# EasyEDA schematic 1-Schematic_Synapse.json

## Sheets
1 Arduino: TITLE: Synapse; REV: 1.1; Date: 2020-05-31; Sheet: 1/3; Drawn By: Arthur LAURENT; Company: Mental Noise
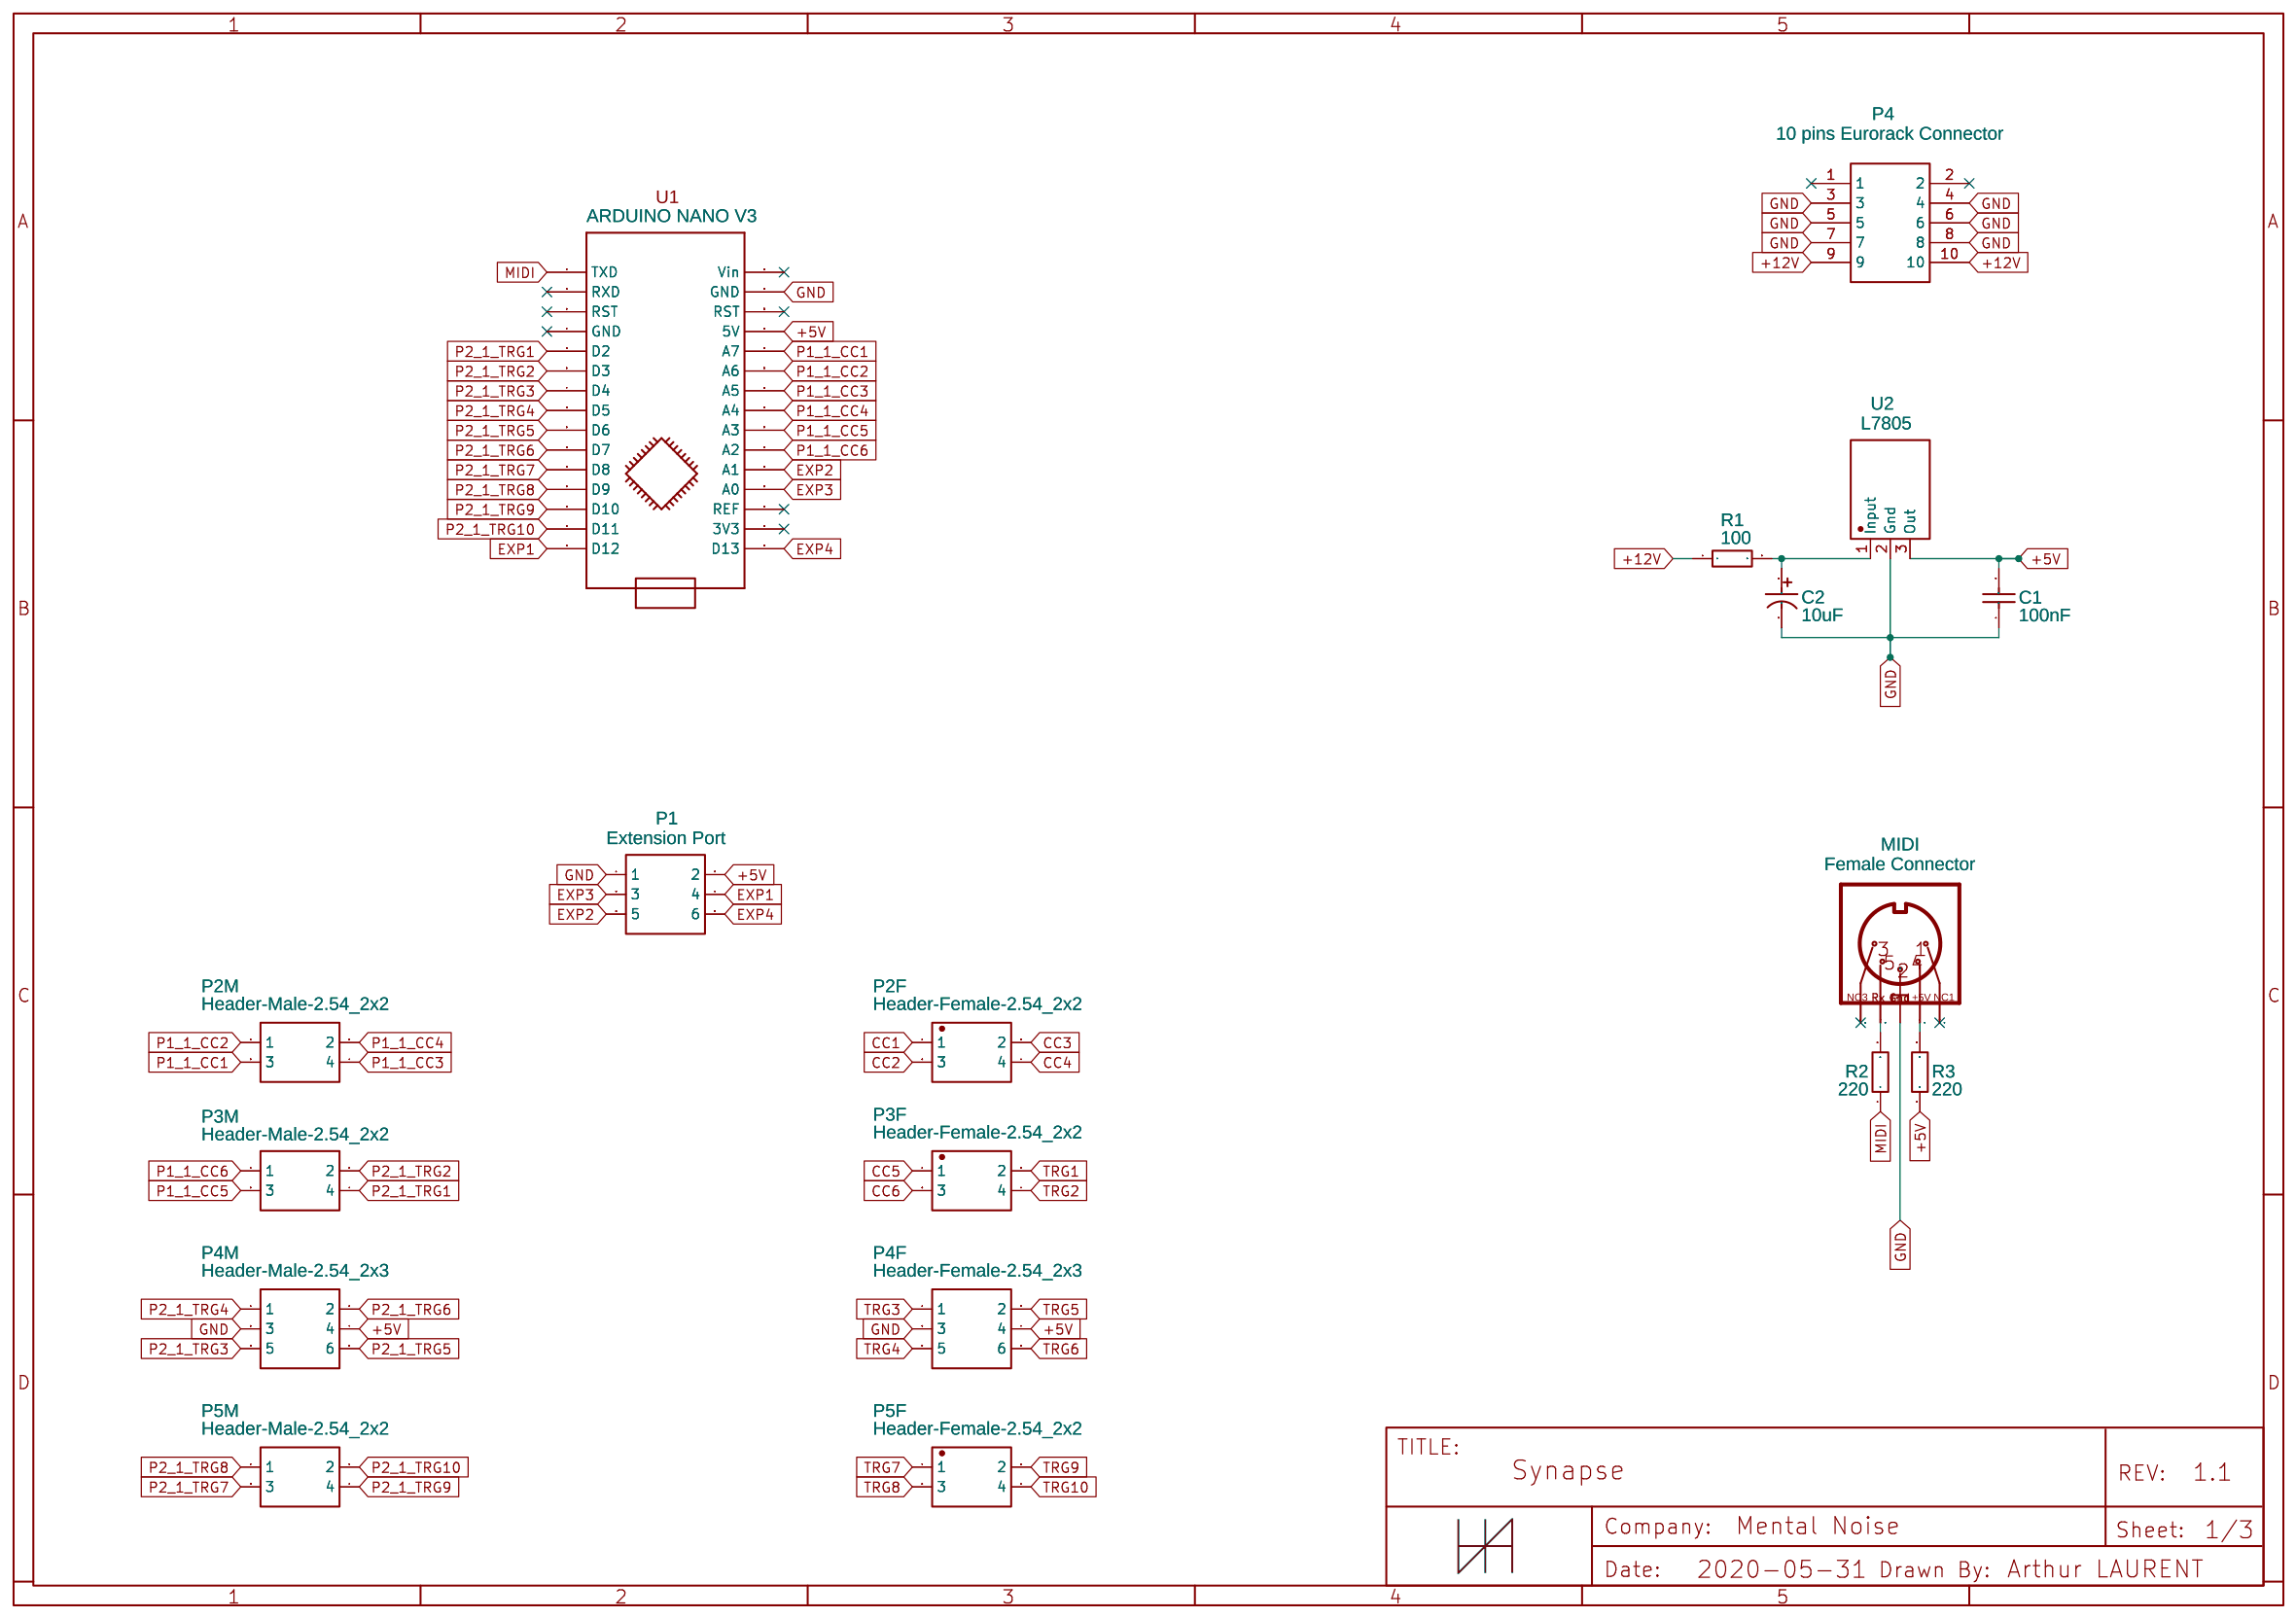
[diagram p0: Arduino]
2 Control Change: Sheet: 2/3
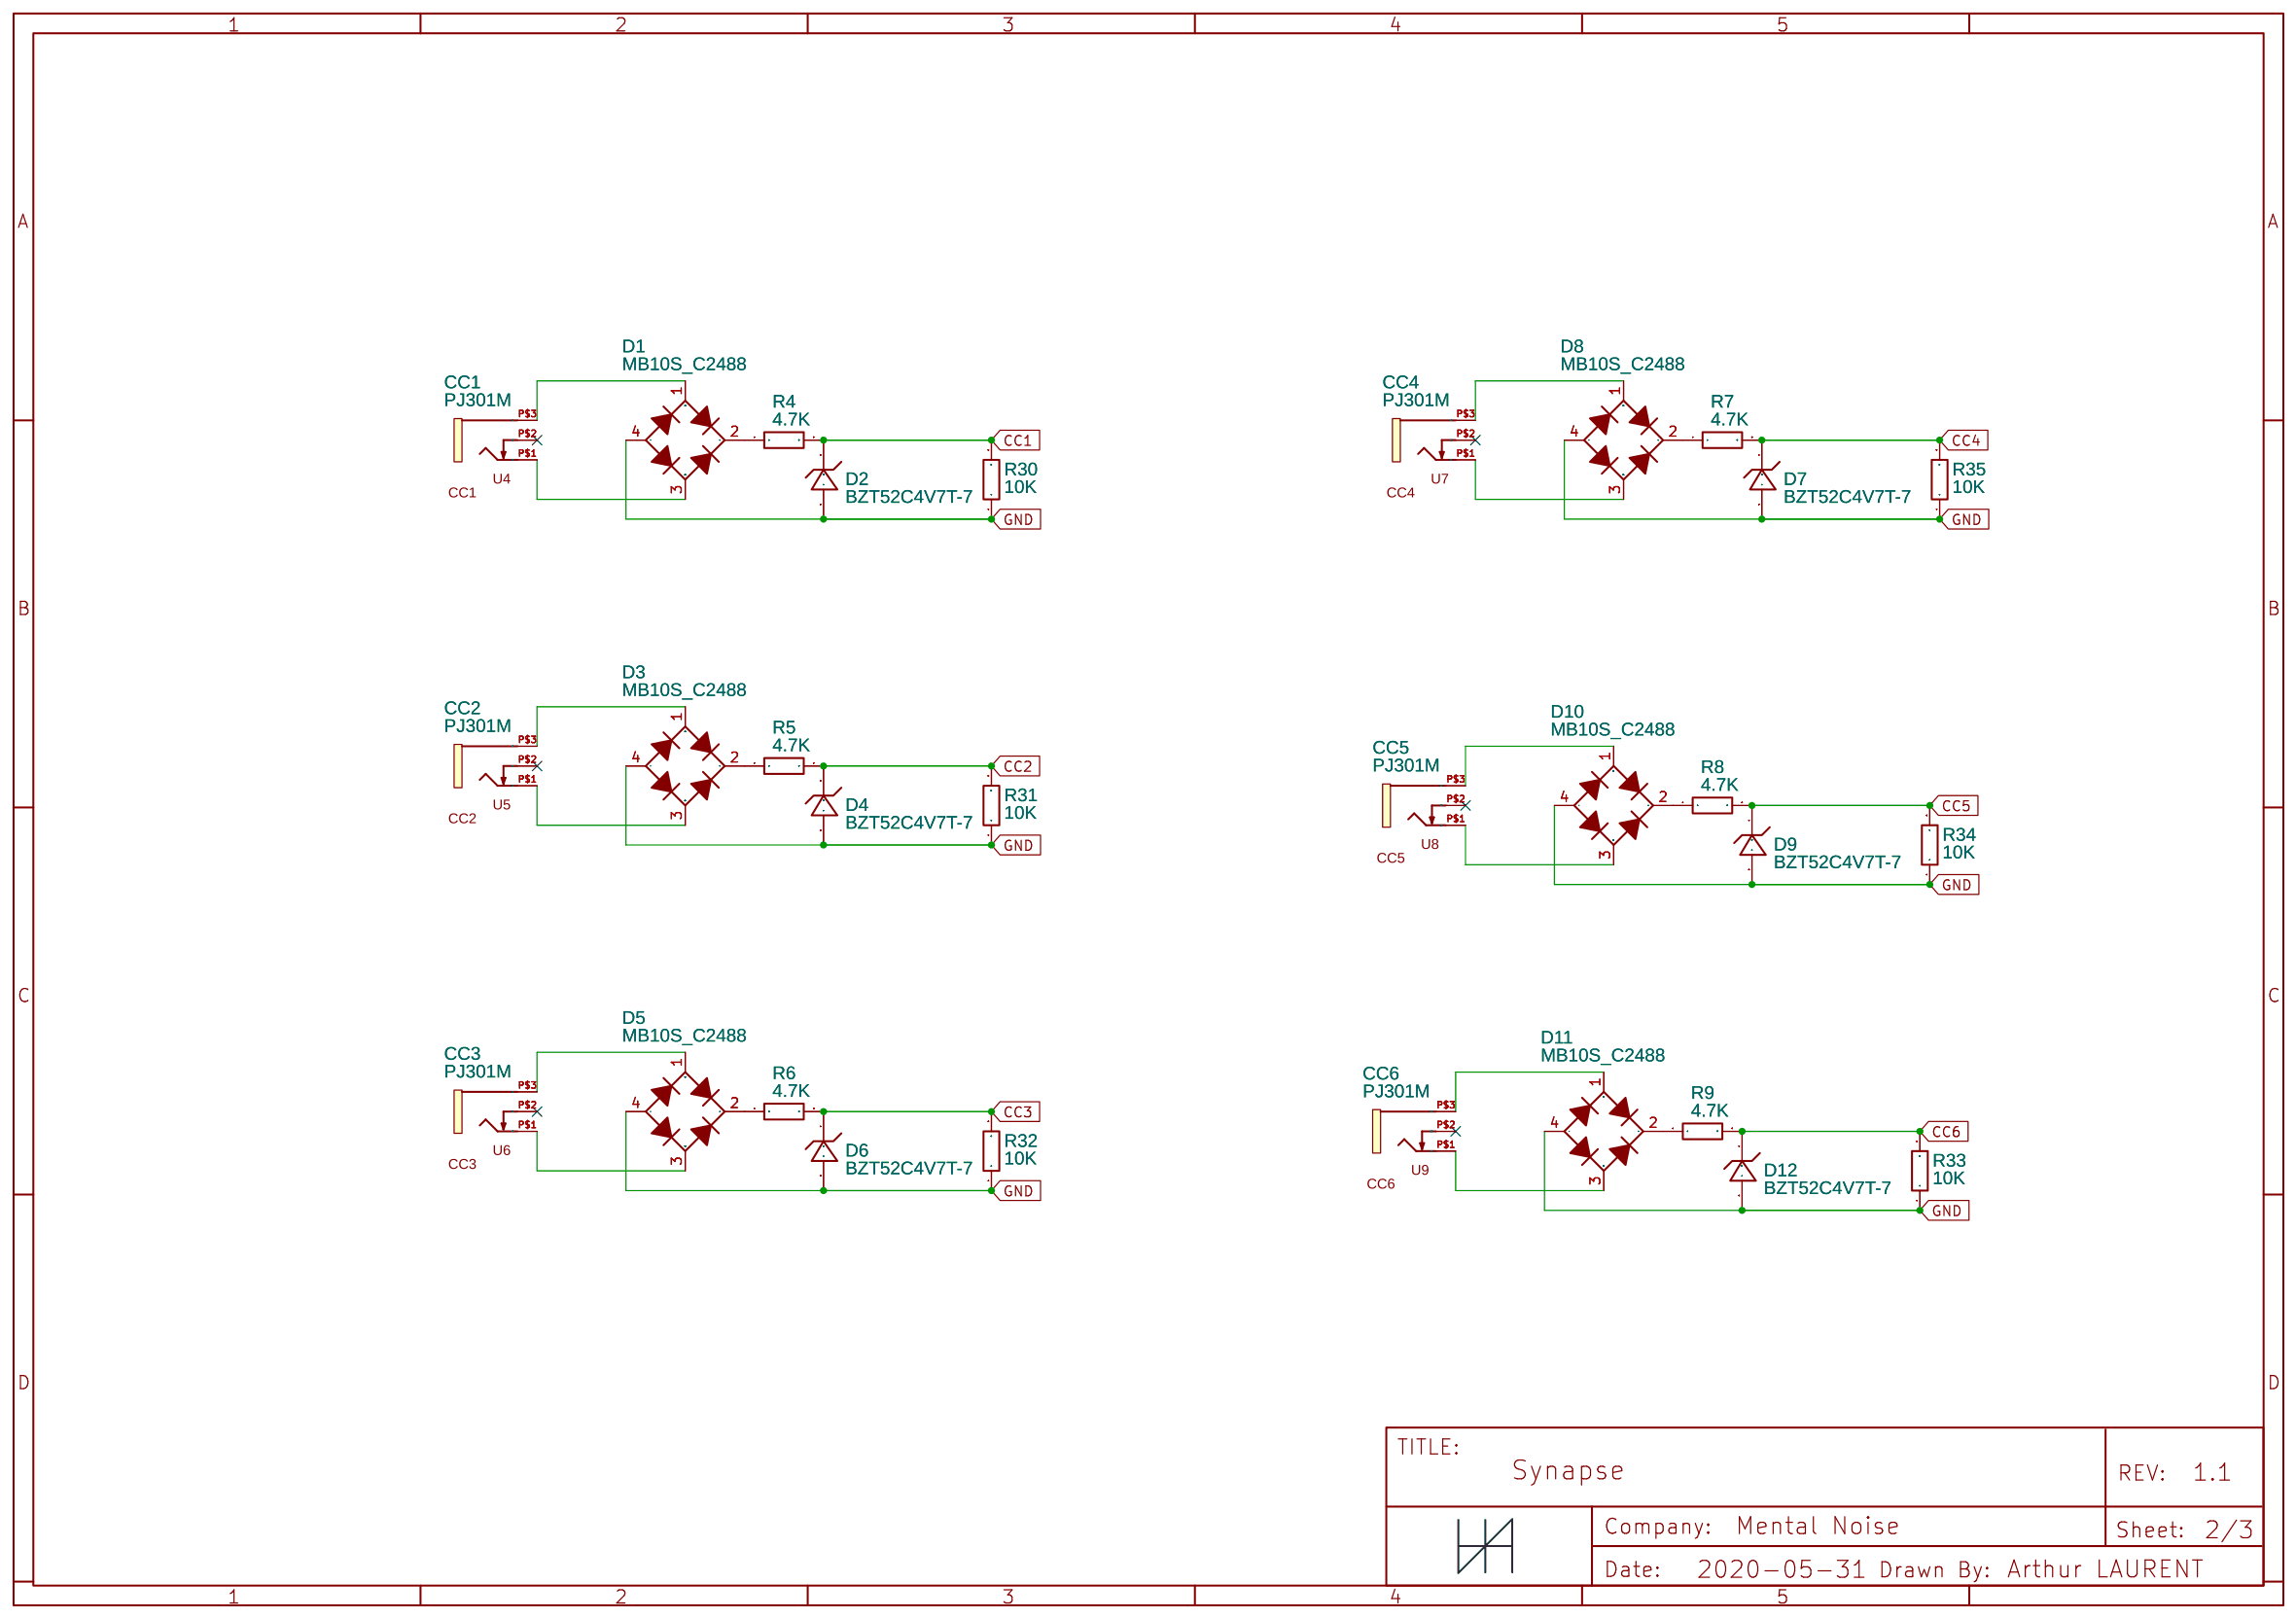
[diagram p1: Control Change]
3 Trigger: Sheet: 3/3
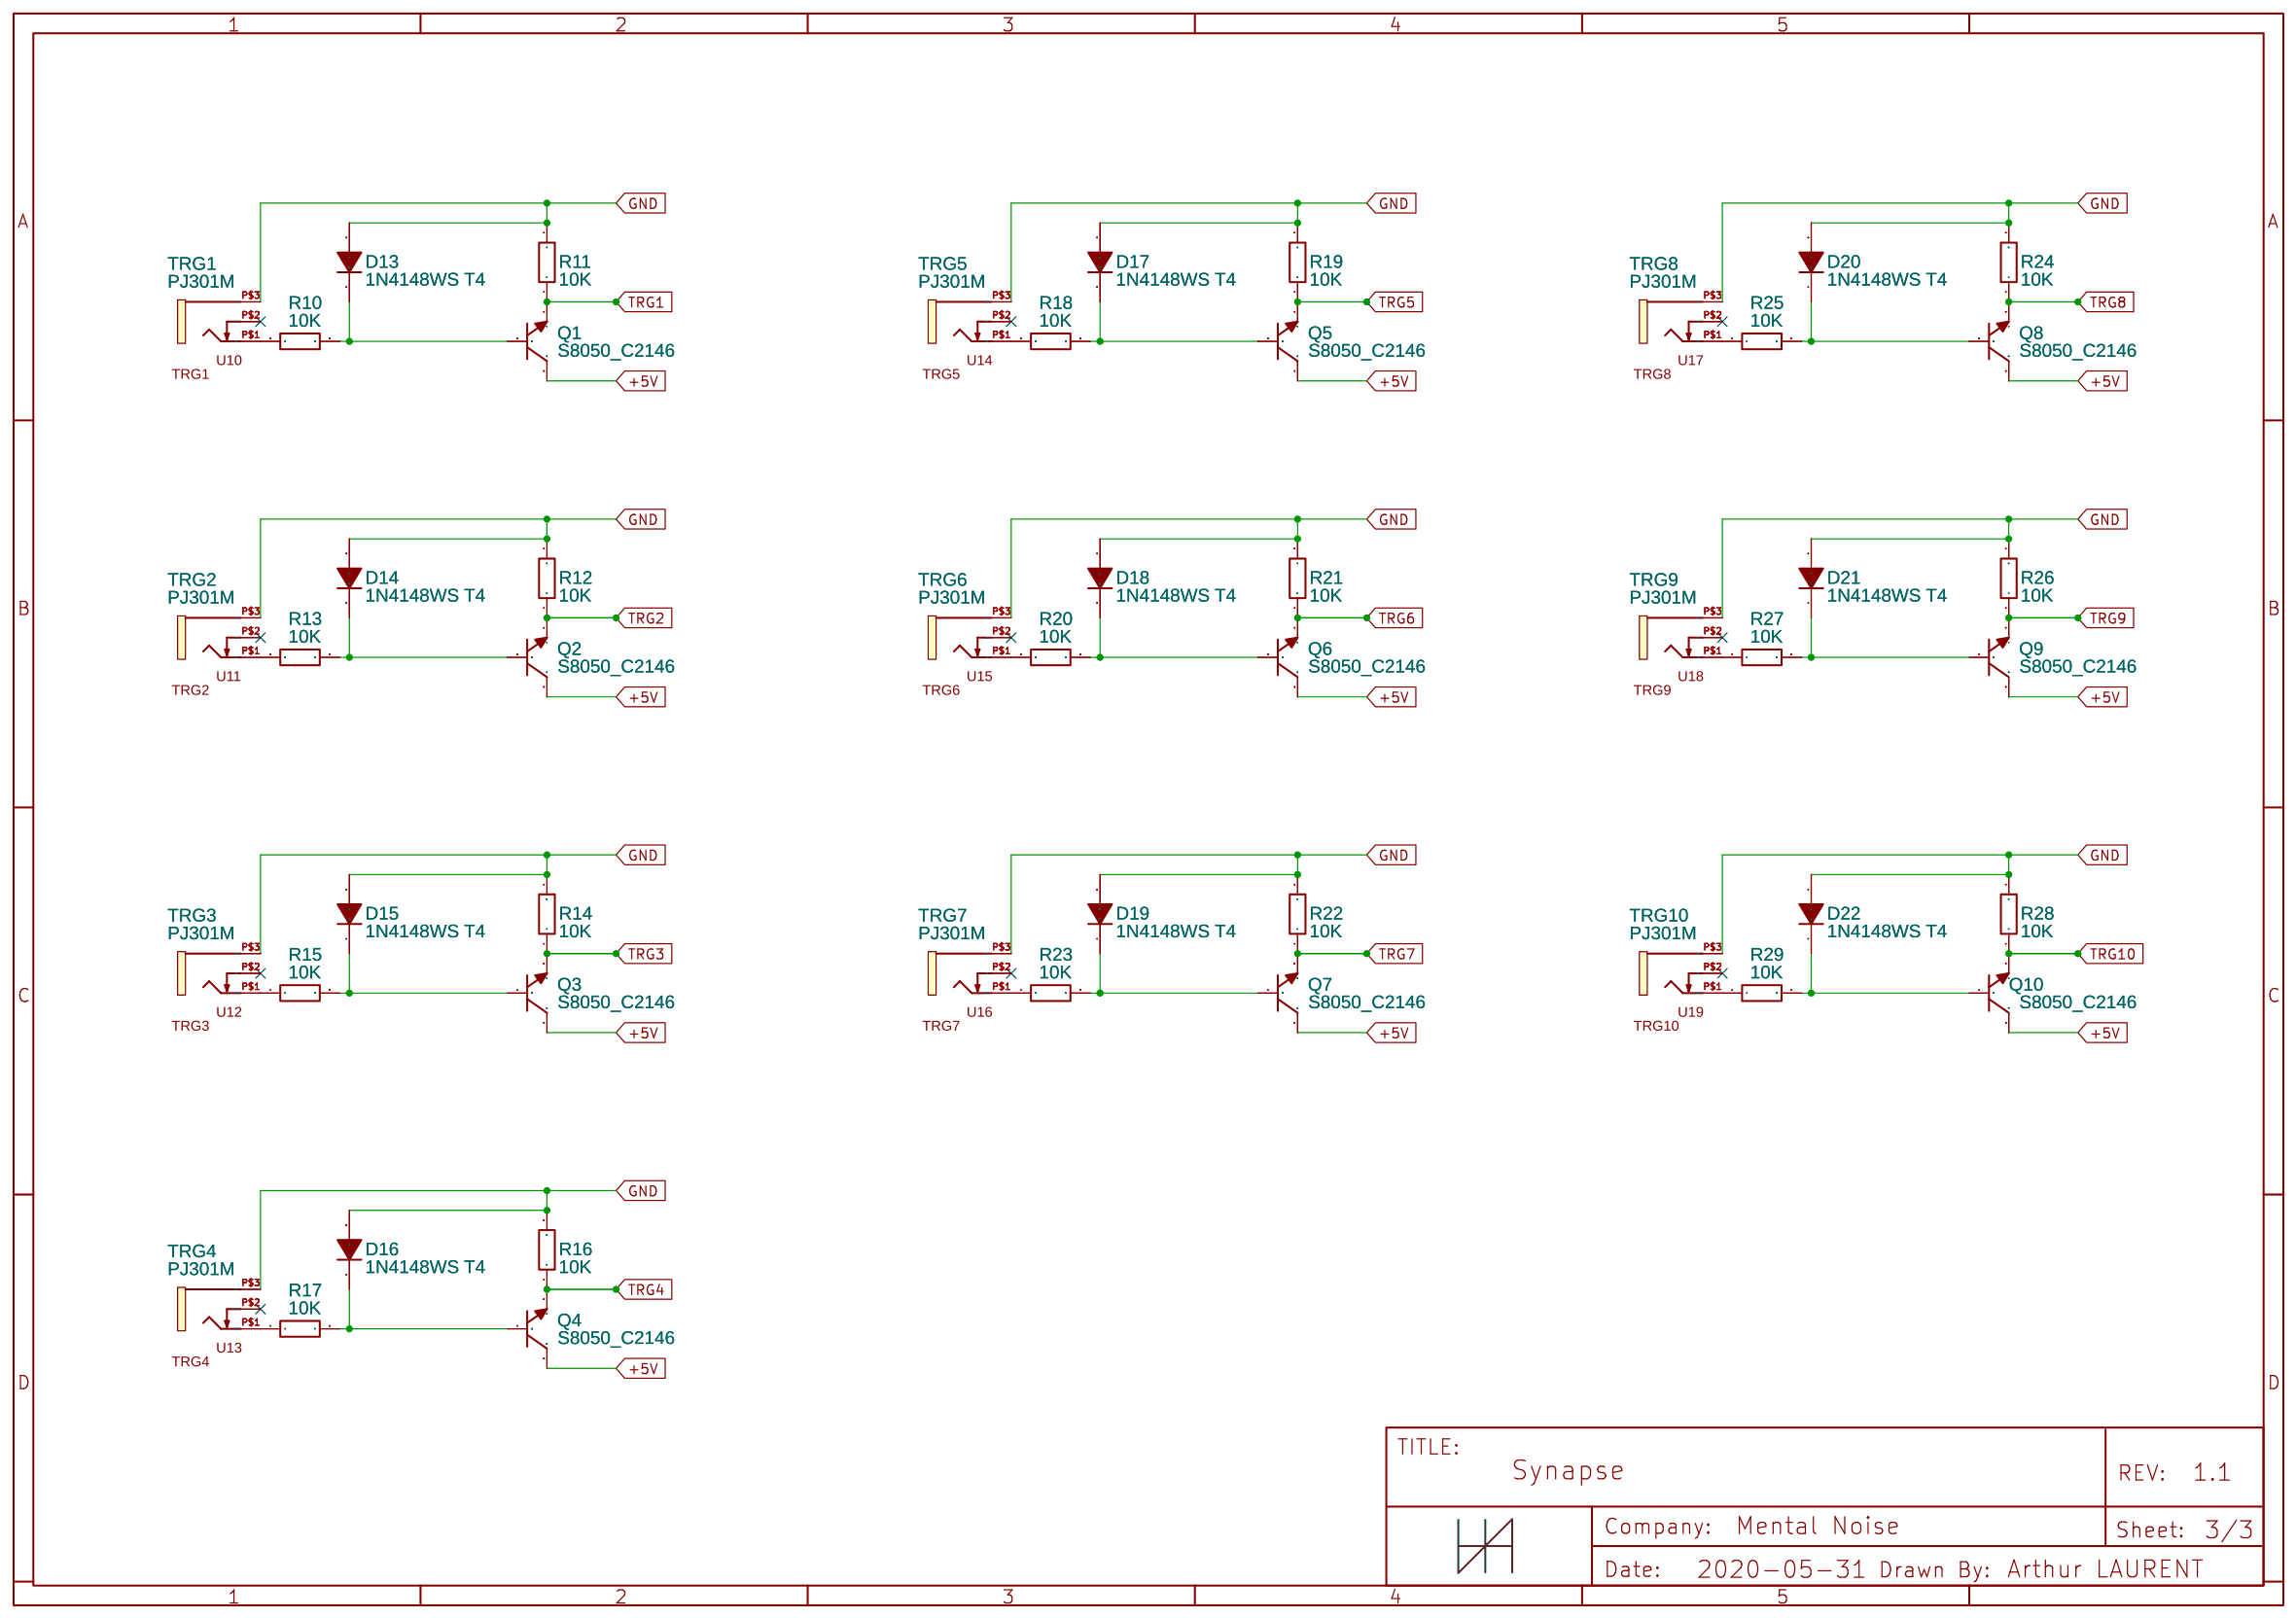
[diagram p2: Trigger]

## Parts
sheet Arduino
C1  100nF  [CERAMIC CAPACITOR_100NF]
C2  10uF  [CAP-TH_BD5.0-P2.00-D0.8-FD]
MIDI  Female Connector  [POT-REMOTE]
P1  Extension Port  [IDC-TH_6P-P2.54_C11214]
P2F  Header-Female-2.54_2x2  [HDR-TH_4P-P2.54-V-R2-C2-S2.54]
P2M  Header-Male-2.54_2x2  [HDR-TH_4P-P2.54-V-R2-C2-S2.54]
P3F  Header-Female-2.54_2x2  [HDR-TH_4P-P2.54-V-R2-C2-S2.54]
P3M  Header-Male-2.54_2x2  [HDR-TH_4P-P2.54-V-R2-C2-S2.54]
P4  10 pins Eurorack Connector  [IDC-TH_10P-P2.54-V-R2-C5-S2.54]
P4F  Header-Female-2.54_2x3  [HDR-TH_6P-P2.54-V-R2-C3-S2.54]
P4M  Header-Male-2.54_2x3  [HDR-TH_6P-P2.54-V-R2-C3-S2.54]
P5F  Header-Female-2.54_2x2  [HDR-TH_4P-P2.54-V-R2-C2-S2.54]
P5M  Header-Male-2.54_2x2  [HDR-TH_4P-P2.54-V-R2-C2-S2.54]
R1  100  [1/4W RESISTOR]
R2  220  [1/4W RESISTOR]
R3  220  [1/4W RESISTOR]
U1  ARDUINO NANO V3  [ARDUINO NANO V3]
U2  L7805  [TO-220-3_L10.0-W4.5-P2.54-L]
sheet Control Change
CC1  PJ301M  [PJ301M]
CC2  PJ301M  [PJ301M]
CC3  PJ301M  [PJ301M]
CC4  PJ301M  [PJ301M]
CC5  PJ301M  [PJ301M]
CC6  PJ301M  [PJ301M]
D1  MB10S_C2488  [DIO-BG-SMD_4P-L4.9-W4.0-P2.54-LS7.0-TL]
D2  BZT52C4V7T-7  [SOD-523_L1.2-W0.8-LS1.6-RD]
D3  MB10S_C2488  [DIO-BG-SMD_4P-L4.9-W4.0-P2.54-LS7.0-TL]
D4  BZT52C4V7T-7  [SOD-523_L1.2-W0.8-LS1.6-RD]
D5  MB10S_C2488  [DIO-BG-SMD_4P-L4.9-W4.0-P2.54-LS7.0-TL]
D6  BZT52C4V7T-7  [SOD-523_L1.2-W0.8-LS1.6-RD]
D7  BZT52C4V7T-7  [SOD-523_L1.2-W0.8-LS1.6-RD]
D8  MB10S_C2488  [DIO-BG-SMD_4P-L4.9-W4.0-P2.54-LS7.0-TL]
D9  BZT52C4V7T-7  [SOD-523_L1.2-W0.8-LS1.6-RD]
D10  MB10S_C2488  [DIO-BG-SMD_4P-L4.9-W4.0-P2.54-LS7.0-TL]
D11  MB10S_C2488  [DIO-BG-SMD_4P-L4.9-W4.0-P2.54-LS7.0-TL]
D12  BZT52C4V7T-7  [SOD-523_L1.2-W0.8-LS1.6-RD]
R4  4.7K  [R0402]
R5  4.7K  [R0402]
R6  4.7K  [R0402]
R7  4.7K  [R0402]
R8  4.7K  [R0402]
R9  4.7K  [R0402]
R30  10K  [R0402]
R31  10K  [R0402]
R32  10K  [R0402]
R33  10K  [R0402]
R34  10K  [R0402]
R35  10K  [R0402]
sheet Trigger
D13  1N4148WS T4  [SOD-323_L1.8-W1.3-LS2.5-RD]
D14  1N4148WS T4  [SOD-323_L1.8-W1.3-LS2.5-RD]
D15  1N4148WS T4  [SOD-323_L1.8-W1.3-LS2.5-RD]
D16  1N4148WS T4  [SOD-323_L1.8-W1.3-LS2.5-RD]
D17  1N4148WS T4  [SOD-323_L1.8-W1.3-LS2.5-RD]
D18  1N4148WS T4  [SOD-323_L1.8-W1.3-LS2.5-RD]
D19  1N4148WS T4  [SOD-323_L1.8-W1.3-LS2.5-RD]
D20  1N4148WS T4  [SOD-323_L1.8-W1.3-LS2.5-RD]
D21  1N4148WS T4  [SOD-323_L1.8-W1.3-LS2.5-RD]
D22  1N4148WS T4  [SOD-323_L1.8-W1.3-LS2.5-RD]
Q1  S8050_C2146  [SOT-23-3_L3.0-W1.7-P0.95-LS2.9-BR]
Q2  S8050_C2146  [SOT-23-3_L3.0-W1.7-P0.95-LS2.9-BR]
Q3  S8050_C2146  [SOT-23-3_L3.0-W1.7-P0.95-LS2.9-BR]
Q4  S8050_C2146  [SOT-23-3_L3.0-W1.7-P0.95-LS2.9-BR]
Q5  S8050_C2146  [SOT-23-3_L3.0-W1.7-P0.95-LS2.9-BR]
Q6  S8050_C2146  [SOT-23-3_L3.0-W1.7-P0.95-LS2.9-BR]
Q7  S8050_C2146  [SOT-23-3_L3.0-W1.7-P0.95-LS2.9-BR]
Q8  S8050_C2146  [SOT-23-3_L3.0-W1.7-P0.95-LS2.9-BR]
Q9  S8050_C2146  [SOT-23-3_L3.0-W1.7-P0.95-LS2.9-BR]
Q10  S8050_C2146  [SOT-23-3_L3.0-W1.7-P0.95-LS2.9-BR]
R10  10K  [R0402]
R11  10K  [R0402]
R12  10K  [R0402]
R13  10K  [R0402]
R14  10K  [R0402]
R15  10K  [R0402]
R16  10K  [R0402]
R17  10K  [R0402]
R18  10K  [R0402]
R19  10K  [R0402]
R20  10K  [R0402]
R21  10K  [R0402]
R22  10K  [R0402]
R23  10K  [R0402]
R24  10K  [R0402]
R25  10K  [R0402]
R26  10K  [R0402]
R27  10K  [R0402]
R28  10K  [R0402]
R29  10K  [R0402]
TRG1  PJ301M  [PJ301M]
TRG2  PJ301M  [PJ301M]
TRG3  PJ301M  [PJ301M]
TRG4  PJ301M  [PJ301M]
TRG5  PJ301M  [PJ301M]
TRG6  PJ301M  [PJ301M]
TRG7  PJ301M  [PJ301M]
TRG8  PJ301M  [PJ301M]
TRG9  PJ301M  [PJ301M]
TRG10  PJ301M  [PJ301M]

## Library data of the parts
C1 = CERAMIC CAPACITOR_100nF: Manufacturer Part: Ceramic capacitor0.1UF50V; Contributor: dearali
C2 = 10uF 50V 5*11: Supplier: LCSC; Manufacturer: ValuePro; Supplier Part: C43345
MIDI = MIDI Connector: Contributor: Janosch_89
P1 = HDR-IDC-2.54-2X3P: Supplier: LCSC; Manufacturer: BOOMELE; Manufacturer Part: 2X3 2.54mm IDC Box; image: //image.lceda.cn/szlcsc/C11214.jpg; Supplier Part: C11214
P2F P3F P5F = Header-Female-2.54_2x2: Supplier: LCSC; Manufacturer: CONNFLY; Manufacturer Part: DS1023-2*2SF11; Contributor: LCSC; Supplier Part: C92273
P2M P3M P5M = Header-Male-2.54_2x2: Supplier: LCSC; Manufacturer: BOOMELE; Manufacturer Part: Double Rows2.54mm2*2pHeaders  Pins; Supplier Part: C66690
P4 = CONN ISP 10P: Supplier: LCSC; Manufacturer: SAMTEC; Manufacturer Part: TST-105-02-G-D; Contributor: LCSC; Supplier Part: C131327
P4F = Header-Female-2.54_2x3: Supplier: LCSC; Manufacturer: CONNFLY; Manufacturer Part: DS1023-2*3SF11; Contributor: LCSC; Supplier Part: C92272
P4M = Header-Male-2.54_2x3: Supplier: LCSC; Manufacturer: BOOMELE; Supplier Part: C65114
R1 = MF1/4W-100Ω±1% T52: Supplier: LCSC; Supplier Part: C119304; Manufacturer: Chian Chia Elec; Contributor: LCSC
R2 R3 = MFR0W4F2200A50: Supplier: LCSC; Manufacturer: UniOhm; Supplier Part: C57439
U1 = ARDUINO NANO V3: Manufacturer Part: arduino_nano1; Contributor: Labamich netvoll
U2 = L7805CV_C347289: Supplier: LCSC; Supplier Part: C347289; Manufacturer: Youtai Semiconductor Co., Ltd.; Manufacturer Part: L7805CV; Contributor: LCSC
CC1-CC6 TRG1-TRG10 = PJ301M: Manufacturer: thonk; link: https://www.thonk.co.uk/shop/thonkiconn/; Contributor: Christian Bloch
D1 D3 D5 D8 D10 D11 = MB10S_C2488: Supplier: LCSC; Manufacturer: MDD; Manufacturer Part: MB10S; LCSC Assembly: Yes; image: //image.lceda.cn/szlcsc/C2488.jpg; Supplier Part: C2488; SMT Type: Basic
D2 D4 D6 D7 D9 D12 = BZT52C4V7T-7: Supplier Part: C151452; Supplier: LCSC; Manufacturer: DIODES; Contributor: LCSC; LCSC Assembly: Yes; SMT Type: Extend
R4-R9 = 0402WGF4701TCE: Supplier: LCSC; Manufacturer: UniOhm; LCSC Assembly: Yes; Supplier Part: C25900; SMT Type: Basic
R10-R35 = 0402WGF1002TCE: Supplier: LCSC; Manufacturer: UniOhm; LCSC Assembly: Yes; Supplier Part: C25744; SMT Type: Basic
D13-D22 = 1N4148WS T4: Supplier: LCSC; Manufacturer: CJ; LCSC Assembly: Yes; image: //image.lceda.cn/szlcsc/C2128.jpg; Supplier Part: C2128; SMT Type: Basic
Q1-Q10 = S8050_C2146: Supplier: LCSC; Manufacturer: CJ; Manufacturer Part: S8050; image: //image.lceda.cn/szlcsc/C2146.jpg; Supplier Part: C2146; LCSC Assembly: Yes; SMT Type: Basic

## Nets
+5V: C1.2 P1.2 P4F.4 P4M.4 Q1.3(C) Q2.3(C) Q3.3(C) Q4.3(C) Q5.3(C) Q6.3(C) Q7.3(C) Q8.3(C) Q9.3(C) Q10.3(C) R3.1 U1.27(5V) U2.3(Out)
+12V: P4.9 P4.10 R1.1
GND: C1.1 C2.2 D1.4(-) D2.2(A) D3.4(-) D4.2(A) D5.4(-) D6.2(A) D7.2(A) D8.4(-) D9.2(A) D10.4(-) D11.4(-) D12.2(A) D13.2(A) D14.2(A) D15.2(A) D16.2(A) D17.2(A) D18.2(A) D19.2(A) D20.2(A) D21.2(A) D22.2(A) MIDI.2 P1.1 P4.3 P4.4 P4.5 P4.6 P4.7 P4.8 P4F.3 P4M.3 R11.2 R12.2 R14.2 R16.2 R19.2 R21.2 R22.2 R24.2 R26.2 R28.2 R30.1 R31.1 R32.1 R33.1 R34.1 R35.1 TRG1.P$3(1) TRG2.P$3(1) TRG3.P$3(1) TRG4.P$3(1) TRG5.P$3(1) TRG6.P$3(1) TRG7.P$3(1) TRG8.P$3(1) TRG9.P$3(1) TRG10.P$3(1) U1.29(GND) U2.2(Gnd)
CC1: D2.1(C) P2F.1 R4.2 R30.2
CC2: D4.1(C) P2F.3 R5.2 R31.2
CC3: D6.1(C) P2F.2 R6.2 R32.2
CC4: D7.1(C) P2F.4 R7.2 R35.2
CC5: D9.1(C) P3F.1 R8.2 R34.2
CC6: D12.1(C) P3F.3 R9.2 R33.2
EXP1: P1.4 U1.15(D12)
EXP2: P1.5 U1.20(A1)
EXP3: P1.3 U1.19(A0)
EXP4: P1.6 U1.16(D13)
MIDI: R2.1 U1.1(TXD)
P1_1_CC1: P2M.3 U1.26(A7)
P1_1_CC2: P2M.1 U1.25(A6)
P1_1_CC3: P2M.4 U1.24(A5)
P1_1_CC4: P2M.2 U1.23(A4)
P1_1_CC5: P3M.3 U1.22(A3)
P1_1_CC6: P3M.1 U1.21(A2)
P2_1_TRG1: P3M.4 U1.5(D2)
P2_1_TRG2: P3M.2 U1.6(D3)
P2_1_TRG3: P4M.5 U1.7(D4)
P2_1_TRG4: P4M.1 U1.8(D5)
P2_1_TRG5: P4M.6 U1.9(D6)
P2_1_TRG6: P4M.2 U1.10(D7)
P2_1_TRG7: P5M.3 U1.11(D8)
P2_1_TRG8: P5M.1 U1.12(D9)
P2_1_TRG9: P5M.4 U1.13(D10)
P2_1_TRG10: P5M.2 U1.14(D11)
TRG1: P3F.2 Q1.2(E) R11.1
TRG2: P3F.4 Q2.2(E) R12.1
TRG3: P4F.1 Q3.2(E) R14.1
TRG4: P4F.5 Q4.2(E) R16.1
TRG5: P4F.2 Q5.2(E) R19.1
TRG6: P4F.6 Q6.2(E) R21.1
TRG7: P5F.1 Q7.2(E) R22.1
TRG8: P5F.3 Q8.2(E) R24.1
TRG9: P5F.2 Q9.2(E) R26.1
TRG10: P5F.4 Q10.2(E) R28.1
Net-(C2-1): C2.1 R1.2 U2.1(Input)
Net-(CC1-P$1): CC1.P$1(2) D1.3(C2)
Net-(CC1-P$3): CC1.P$3(1) D1.1(C1)
Net-(CC2-P$1): CC2.P$1(2) D3.3(C2)
Net-(CC2-P$3): CC2.P$3(1) D3.1(C1)
Net-(CC3-P$1): CC3.P$1(2) D5.3(C2)
Net-(CC3-P$3): CC3.P$3(1) D5.1(C1)
Net-(CC4-P$1): CC4.P$1(2) D8.3(C2)
Net-(CC4-P$3): CC4.P$3(1) D8.1(C1)
Net-(CC5-P$1): CC5.P$1(2) D10.3(C2)
Net-(CC5-P$3): CC5.P$3(1) D10.1(C1)
Net-(CC6-P$1): CC6.P$1(2) D11.3(C2)
Net-(CC6-P$3): CC6.P$3(1) D11.1(C1)
Net-(D1-2): D1.2(+) R4.1
Net-(D3-2): D3.2(+) R5.1
Net-(D5-2): D5.2(+) R6.1
Net-(D8-2): D8.2(+) R7.1
Net-(D10-2): D10.2(+) R8.1
Net-(D11-2): D11.2(+) R9.1
Net-(D13-1): D13.1(K) Q1.1(B) R10.2
Net-(D14-1): D14.1(K) Q2.1(B) R13.2
Net-(D15-1): D15.1(K) Q3.1(B) R15.2
Net-(D16-1): D16.1(K) Q4.1(B) R17.2
Net-(D17-1): D17.1(K) Q5.1(B) R18.2
Net-(D18-1): D18.1(K) Q6.1(B) R20.2
Net-(D19-1): D19.1(K) Q7.1(B) R23.2
Net-(D20-1): D20.1(K) Q8.1(B) R25.2
Net-(D21-1): D21.1(K) Q9.1(B) R27.2
Net-(D22-1): D22.1(K) Q10.1(B) R29.2
Net-(MIDI-1): MIDI.1(5) R2.2
Net-(MIDI-3): MIDI.3(4) R3.2
Net-(R10-1): R10.1 TRG1.P$1(2)
Net-(R13-1): R13.1 TRG2.P$1(2)
Net-(R15-1): R15.1 TRG3.P$1(2)
Net-(R17-1): R17.1 TRG4.P$1(2)
Net-(R18-1): R18.1 TRG5.P$1(2)
Net-(R20-1): R20.1 TRG6.P$1(2)
Net-(R23-1): R23.1 TRG7.P$1(2)
Net-(R25-1): R25.1 TRG8.P$1(2)
Net-(R27-1): R27.1 TRG9.P$1(2)
Net-(R29-1): R29.1 TRG10.P$1(2)

Not connected (* = marked no-connect by the designer): CC1 P$2(3)*; CC2 P$2(3)*; CC3 P$2(3)*; CC4 P$2(3)*; CC5 P$2(3)*; CC6 P$2(3)*; P4 1* 2*; TRG1 P$2(3)*; TRG2 P$2(3)*; TRG3 P$2(3)*; TRG4 P$2(3)*; TRG5 P$2(3)*; TRG6 P$2(3)*; TRG7 P$2(3)*; TRG8 P$2(3)*; TRG9 P$2(3)*; TRG10 P$2(3)*; U1 2(RXD)* 3(RST)* 4(GND)* 17(3V3)* 18(REF)* 28(RST)* 30(Vin)*
